# Altium schematic sheet asurt_sch1.SchDoc
size A3; SheetNumber: 1; SheetTotal: 1
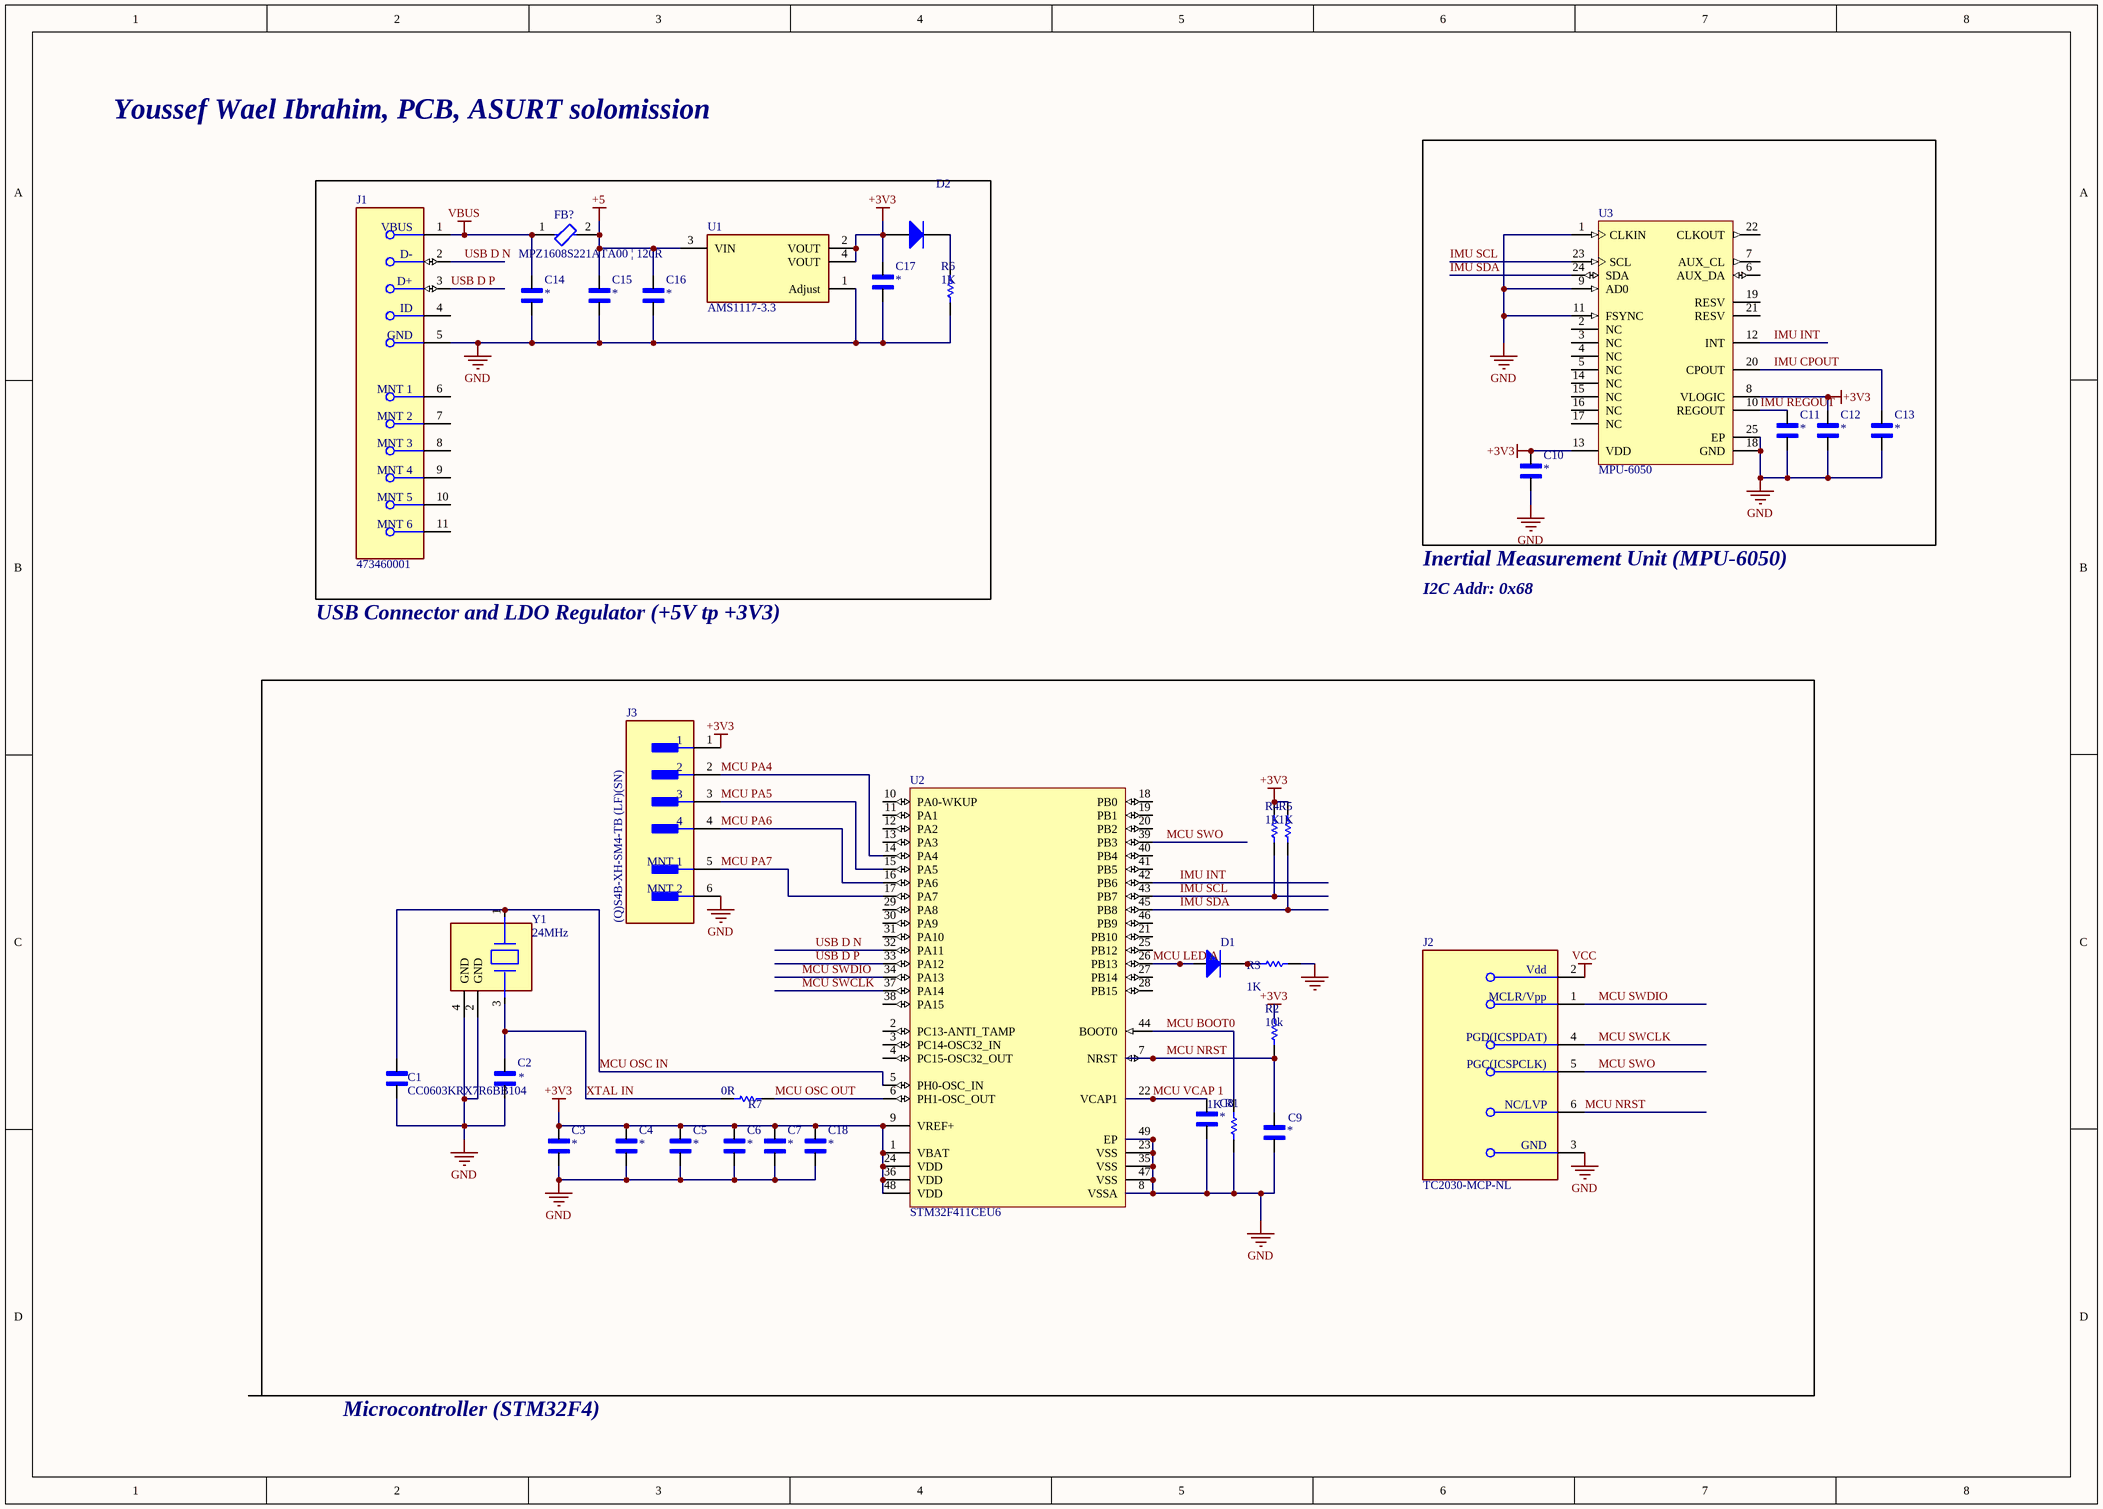
[diagram p0: asurt_sch1.SchDoc]

## Parts
C1  CC0603KRX7R6BB104  [CAPC1608X90]
C2  CC0603KRX7R6BB104  [CAPC1608X90]  (value not drawn)
C3  CC0603KRX7R6BB104  [CAPC1608X90]  (value not drawn)
C4  CC0603KRX7R6BB104  [CAPC1608X90]  (value not drawn)
C5  CC0603KRX7R6BB104  [CAPC1608X90]  (value not drawn)
C6  CC0603KRX7R6BB104  [CAPC1608X90]  (value not drawn)
C7  CC0603KRX7R6BB104  [CAPC1608X90]  (value not drawn)
C8  CC0603KRX7R6BB104  [CAPC1608X90]  (value not drawn)
C9  CC0603KRX7R6BB104  [CAPC1608X90]  (value not drawn)
C10  CC0603KRX7R6BB104  [CAPC1608X90]  (value not drawn)
C11  CC0603KRX7R6BB104  [CAPC1608X90]  (value not drawn)
C12  CC0603KRX7R6BB104  [CAPC1608X90]  (value not drawn)
C13  CC0603KRX7R6BB104  [CAPC1608X90]  (value not drawn)
C14  CC0603KRX7R6BB104  [CAPC1608X90]  (value not drawn)
C15  CC0603KRX7R6BB104  [CAPC1608X90]  (value not drawn)
C16  CC0603KRX7R6BB104  [CAPC1608X90]  (value not drawn)
C17  CC0603KRX7R6BB104  [CAPC1608X90]  (value not drawn)
C18  CC0603KRX7R6BB104  [CAPC1608X90]  (value not drawn)
D1  Diode  [SMC]  (value not drawn)
D2  Diode  [SMC]  (value not drawn)
FB?  MPZ1608S221ATA00 | 120R  [FP-MPZ1608-0_8-MFG]
J1  473460001  [FP-473460001-MFG]
J2  TC2030-MCP-NL  [FP-TC2030-MCP-NL-MFG]
J3  (Q)S4B-XH-SM4-TB (LF)(SN)  [FP-Q_S4B-XH-SM4-TB_LF-MFG]
R1  value 1K  [AXIAL-0.3]  (hidden comment: Res1)
R2  value 10k  [AXIAL-0.3]  (hidden comment: Res1)
R3  value 1K  [AXIAL-0.3]  (hidden comment: Res1)
R4  value 1K  [AXIAL-0.3]  (hidden comment: Res1)
R5  value 1K  [AXIAL-0.3]  (hidden comment: Res1)
R6  value 1K  [AXIAL-0.3]  (hidden comment: Res1)
R7  value 0R  [AXIAL-0.3]  (hidden comment: Res1)
U1  AMS1117-3.3  [FP-ams1117-IPC_C]
U2  STM32F411CEU6  [STM-UFQFPN48_L]
U3  MPU-6050  [IS-QFN-24_V]
Y1  24MHz  [FP-TSX-3225-MFG]

## Nets
+3V3: C3.1 C4.1 C5.1 C6.1 C7.1 C10.1 C12.1 C17.1 C18.1 D2.1(A) J3.1 R2.2 R4.2 R5.2 U1.2(VOUT) U1.4(VOUT) U2.1(VBAT) U2.9(VREF+) U2.24(VDD) U2.36(VDD) U2.48(VDD) U3.8(VLOGIC) U3.13(VDD)
+5: C15.1 C16.1 FB?.2 U1.3(VIN)
GND: C1.2 C2.2 C3.2 C4.2 C5.2 C6.2 C7.2 C8.2 C9.2 C10.2 C11.2 C12.2 C13.2 C14.2 C15.2 C16.2 C17.2 C18.2 J1.5(GND) J2.3(GND) J3.6(MNT_2) R1.1 R6.1 U1.1(Adjust) U2.8(VSSA) U2.23(VSS) U2.35(VSS) U2.47(VSS) U2.49(EP) U3.1(CLKIN) U3.9(AD0) U3.11(FSYNC) U3.18(GND) U3.25(EP) Y1.2(GND) Y1.4(GND)
VBUS: C14.1 FB?.1 J1.1(VBUS)
VCC: J2.2(Vdd)
IMU CPOUT: C13.1 U3.20(CPOUT)
IMU INT: U2.42(PB6) U3.12(INT)
IMU REGOUT: C11.1 U3.10(REGOUT)
IMU SCL: R4.1 U2.43(PB7) U3.23(SCL)
IMU SDA: R5.1 U2.45(PB8) U3.24(SDA)
MCU BOOT0: R1.2 U2.44(BOOT0)
MCU LED A: D1.1(A) U2.26(PB13)
MCU NRST: C9.1 J2.6(NC/LVP) R2.1 U2.7(NRST)
MCU OSC IN: C1.1 U2.5(PH0-OSC_IN) Y1.1
MCU OSC OUT: R7.1 U2.6(PH1-OSC_OUT)
MCU PA4: J3.2 U2.14(PA4)
MCU PA5: J3.3 U2.15(PA5)
MCU PA6: J3.4 U2.16(PA6)
MCU PA7: J3.5(MNT_1) U2.17(PA7)
MCU SWCLK: J2.4(PGD(ICSPDAT)) U2.37(PA14)
MCU SWDIO: J2.1(MCLR/Vpp) U2.34(PA13)
MCU SWO: J2.5(PGC(ICSPCLK)) U2.39(PB3)
MCU VCAP 1: C8.1 U2.22(VCAP1)
USB D N: J1.2(D-) U2.32(PA11)
USB D P: J1.3(D+) U2.33(PA12)
XTAL IN: C2.1 R7.2 Y1.3
NetD1_2: D1.2(K) R3.2
NetD2_2: D2.2(K) R6.2

Not connected (* = marked no-connect by the designer): J1 4(ID) 6(MNT_1) 7(MNT_2) 8(MNT_3) 9(MNT_4) 10(MNT_5) 11(MNT_6); R3 1; U2 2(PC13-ANTI_TAMP) 3(PC14-OSC32_IN) 4(PC15-OSC32_OUT) 10(PA0-WKUP) 11(PA1) 12(PA2) 13(PA3) 18(PB0) 19(PB1) 20(PB2) 21(PB10) 25(PB12) 27(PB14) 28(PB15) 29(PA8) 30(PA9) 31(PA10) 38(PA15) 40(PB4) 41(PB5) 46(PB9); U3 2(NC) 3(NC) 4(NC) 5(NC) 6(AUX_DA) 7(AUX_CL) 14(NC) 15(NC) 16(NC) 17(NC) 19(RESV) 21(RESV) 22(CLKOUT)

## Notes on the sheet
- Youssef Wael Ibrahim, PCB, ASURT solomission
- Inertial Measurement Unit (MPU-6050)
- USB Connector and LDO Regulator (+5V tp +3V3)
- I2C Addr: 0x68
- Microcontroller (STM32F4)

## Library data of the parts
C1-C18 = CC0603KRX7R6BB104: 0.1 ÂµF Â±10% 10V Ceramic Capacitor X7R 0603 (1608 Metric); MF: Yageo; SnapEDA_Link: https://www.snapeda.com/parts/CC0603KRX7R6BB104/Yageo/view-part/?ref=snap; Package: 0603 Yageo; Value: *; MP: CC0603KRX7R6BB104; Check_prices: https://www.snapeda.com/parts/CC0603KRX7R6BB104/Yageo/view-part/?ref=eda
D1 D2 = Diode: Default Diode; Published: 8-Jun-2000; LatestRevisionDate: 17-Jul-2002; LatestRevisionNote: Re-released for DXP Platform.; PackageVersion: Sep-1996; PackageReference: SMC; Publisher: Altium Limited; PackageDescription: DO-214-AB/SMC; 2 C-Bend Leads; Body 7.9 x 5.9 mm, inc. leads (LxW); Code_JEDEC: DO-214-AB
FB? = CMP-08257-000028-1: Power line Ferrite Bead 220Ω @ 100MHz 2.2A DCR 0.05Ω SMD 0603; DC Resistance (DCR): 50mR; Tolerance: 25%; Impedance: 220R; Series: MPZ; Width: 0.031inch; REACH SVHC: No SVHC; Case Code (Imperial): 0603; Current Rating: 2.2A; Case/Package: 0603; Packaging: Cut Tape; Height: 0.037inch; Number of Pins: 2; Max DC Current: 2.2A; Lead Free: Lead Free; RoHS Compliant: Yes; Mount: Surface Mount; Case Code (Metric): 1608; Length: 0.063inch; Package Quantity: 1; Core Material: Ferrite
J1 = CMP-2000-05246-2: CONN RCPT USB2.0 MICRO B SMD R/A; Manufacturer: Molex; Conn Orientation: Right Angle; Is Female: yes; Shielding: true; Pitch: 0.65mm; Number Of Contacts: 5; Voltage Rating: 30V; Current Rating: 1.8A; Device Class L2: USB Connectors; Digikey Description: CONN RCPT USB2.0 MICRO B SMD R/A; Height: 2.945mm; RoHS: TRUE; ComponentLink2Description: Datasheet; Octopart: https://octopart.com/47346-0001-molex-7164928; Automotive: No; Package: 0; Category: Conn; Device Class L1: Connectors; Usb Standard: USB 2.0; Temperature: -30°C to +85°C; Temperature Range Low: -30°C; Footprint Url: https://www.molex.com/pdm_docs/sd/473460001_sd.pdf; ComponentLink2URL: https://www.molex.com/webdocs/datasheets/pdf/en-us/0473460001_IO_CONNECTORS.pdf; Lead Free: Yes; Manufacturer Part Number: 473460001; Contact Material: Gold,Nickel; Temperature Range High: +85°C; Device Class L3: unset
J2 = CMP-205963-000002-1: CABLE TAG-CONNECT IN-CIRCUIT; RoHS Compliant: Yes; Series: -; Reach SVHC Compliant: Yes; Package Quantity: 1; Lead Free: Lead Free
J3 = CMP-17439-000477-1: CONN HEADER SMD R/A 4POS 2.5MM
R1-R7 = Res1: Resistor; Published: 8-Jun-2000; LatestRevisionDate: 17-Jul-2002; LatestRevisionNote: Re-released for DXP Platform.; PackageReference: AXIAL-0.3; Publisher: Altium Limited; PackageDescription: Axial Device, Thru-Hole; 2 Leads; 0.3 in Pin Spacing
U1 = CMP-209535-000002-1: 1A LOW DROPOUT VOLTAGE REGULATOR; RoHS Compliant: Yes
U2 = CMP-0243-00165-1: ARM Cortex-M4 32-bit MCU+FPU, 512 KB Flash, 128 KB RAM, 36 I/Os, 48-Pin UFQFPN, -40 to 85 degC, Tray; Operating Frequency(F) (Processor speed) (MHz): 100; FLASH Size (Prog) (kB): 512; Internal RAM Size (kB): 128; I/Os (High Current): 36; Supply Voltage(Vcc) min (V): 1.7; Package Reference: 48-Pin Ultra Thin Fine Pitch Quad Flat No-Lead, 7 x 7 x 0.6 mm Body, 0.5 mm Pitch, Exposed Pad; ComponentLink1Description: Manufacturer URL; ComponentLink1URL: http://www.st.com/; Packing: Tray; Package Description: UFQFPN48; Core: ARM Cortex-M4; ComponentLink2Description: Datasheet; ComponentLink2URL: http://www.st.com/st-web-ui/static/active/en/resource/technical/document/datasheet/DM00115249.pdf; DatasheetVersion: Rev. 6; Mounting Technology: Surface Mount
U3 = CMP-1753-00002-2: 3-Axis Gyroscope, Accelerometer and a Digital Motion Processor(TM) (DMP), 2.375 to 3.46 V, -40 to 85 degC, 24-Pin QFN, RoHS, Tape and Reel; Manufacturer: InvenSense; Featured Product: MPU-60506-Axis,IntegratedI²CSolution; Other Names: 1428-1007-2 / MPU6050; Sensor Type: MotionTracking; Online Catalog: MPU-6000™Series; Unit PriceUSD: Digital; Datasheet Version: Rev. 3.3, 05/2012; Category: Sensors,Transducers; Datasheet URL: http://datasheet.octopart.com/MPU-6050-InvenSense-datasheet-14421344.pdf; Family: Multifunction; Standard Package: 5,000; Manufacturer URL: http://www.invensense.com/; Output Type: Digital; Dynamic Catalog: MPU-6000™Series
Y1 = CMP-36405-000018-1: CRYSTAL 24.0000MHZ 9PF SMD; ESR (Equivalent Series Resistance): 40R; Frequency Stability: 20ppm; Tolerance: 10ppm; Drive Level: 200uW; Min Operating Temperature: -40°C; RoHS Compliant: Yes; Width: 2.5mm; Max Operating Temperature: 105°C; Package Quantity: 250; Load Capacitance: 9pF; Mount: Surface Mount; Lead Free: Lead Free; Height: 0.024inch; Depth: 2.5mm; Frequency: 24MHz; Packaging: Tape and Reel; Series: TSX-3225; Weight: 0.000564oz; Number of Pins: 4; Termination: SMD/SMT; Case/Package: SMD/SMT; Length: 3.2mm; Frequency Tolerance: 10ppm